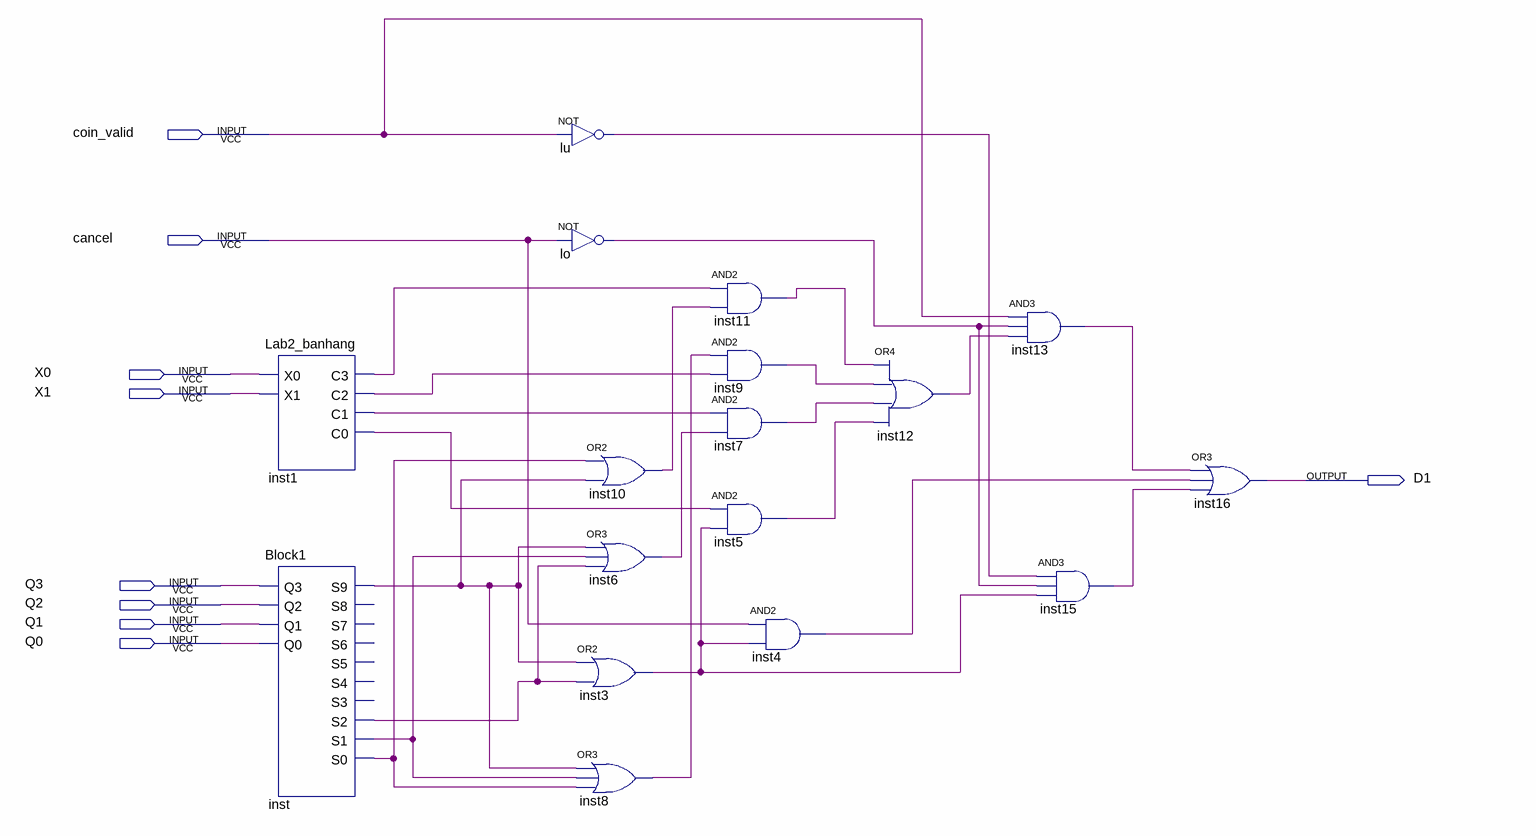
[diagram p0: schematic sheet]
// Quartus schematic block8.bdf as structural Verilog: 17 symbols, 9 pins
module block8 (
  input  coin_valid,
  input  cancel,
  input  X0,
  input  X1,
  input  Q3,
  input  Q2,
  input  Q1,
  input  Q0,
  output D1
);

  wire inst1_c0, inst1_c1, inst1_c2, inst1_c3, inst3_out, inst4_out, inst5_out, inst6_out, inst7_out,
       inst8_out, inst9_out, inst10_out, inst11_out, inst12_out, inst13_out, inst15_out, inst_s0, inst_s1,
       inst_s2, inst_s9, lo_out, lu_out;

  Lab2_banhang inst1 (.X0(X0), .X1(X1), .C3(inst1_c3), .C2(inst1_c2), .C1(inst1_c1), .C0(inst1_c0));
  Block1 inst (
    .Q3(Q3), .Q2(Q2), .Q1(Q1), .Q0(Q0), .S9(inst_s9), .S2(inst_s2), .S1(inst_s1), .S0(inst_s0));  // open: S8, S7, S6, S5, S4, S3
  not lu (lu_out, coin_valid);
  not lo (lo_out, cancel);
  or inst10 (inst10_out, inst_s0, inst_s9);
  or inst6 (inst6_out, inst_s9, inst_s1, inst_s2);
  or inst3 (inst3_out, inst_s9, inst_s2);
  or inst8 (inst8_out, inst_s9, inst_s1, inst_s0);
  and inst11 (inst11_out, inst1_c3, inst10_out);
  and inst9 (inst9_out, inst8_out, inst1_c2);
  and inst7 (inst7_out, inst1_c1, inst6_out);
  and inst5 (inst5_out, inst1_c0, inst3_out);
  and inst4 (inst4_out, cancel, inst3_out);
  or inst12 (inst12_out, inst11_out, inst9_out, inst7_out, inst5_out);
  and inst13 (inst13_out, coin_valid, lo_out, inst12_out);
  and inst15 (inst15_out, lu_out, lo_out, inst3_out);
  or inst16 (D1, inst13_out, inst4_out, inst15_out);
endmodule
